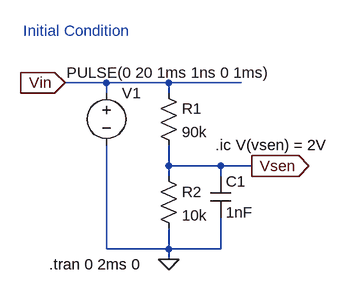
[diagram p0: schematic LTspice 02-2 ic.asc]
LTspice 02-2 ic.asc, the LTspice schematic file:
Version 4
SHEET 1 916 680
WIRE 400 192 336 192
WIRE 496 192 400 192
WIRE 608 192 496 192
WIRE 400 208 400 192
WIRE 496 208 496 192
WIRE 496 320 496 288
WIRE 576 320 496 320
WIRE 624 320 576 320
WIRE 496 336 496 320
WIRE 576 336 576 320
WIRE 400 448 400 288
WIRE 496 448 496 416
WIRE 496 448 400 448
WIRE 576 448 576 400
WIRE 576 448 496 448
WIRE 496 464 496 448
FLAG 496 464 0
FLAG 624 320 Vsen
IOPIN 624 320 Out
FLAG 336 192 Vin
IOPIN 336 192 In
SYMBOL voltage 400 192 R0
WINDOW 123 0 0 Left 2
WINDOW 39 0 0 Left 2
WINDOW 3 -61 -16 Left 2
SYMATTR Value PULSE(0 20 1ms 1ns 0 1ms)
SYMATTR InstName V1
SYMBOL res 480 192 R0
SYMATTR InstName R1
SYMATTR Value 90k
SYMBOL res 480 320 R0
SYMATTR InstName R2
SYMATTR Value 10k
SYMBOL cap 560 336 R0
SYMATTR InstName C1
SYMATTR Value 1nF
TEXT 312 472 Left 2 !.tran 0 2ms 0
TEXT 272 112 Left 2 ;Initial Condition
TEXT 568 288 Left 2 !.ic V(vsen) = 2V

The netlist it stands for:
* LTspice 02-2 ic.asc
V1 Vin 0 PULSE(0 20 1ms 1ns 0 1ms)
R1 Vin Vsen 90k
R2 Vsen 0 10k
C1 Vsen 0 1nF
.tran 0 2ms 0
* Initial Condition
.ic V(vsen) = 2V
.backanno
.end